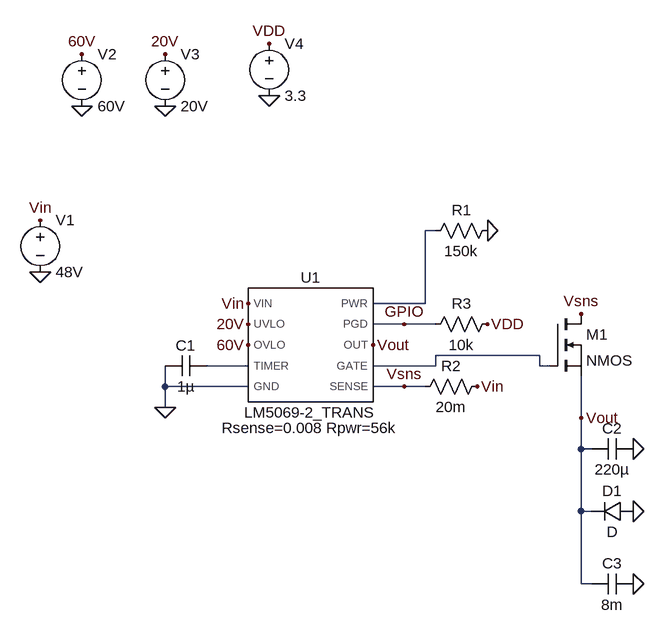
[diagram p0: schematic LM5069_SPICE.asc]
LM5069_SPICE.asc, the LTspice schematic file:
Version 4
SHEET 1 880 680
WIRE 432 -48 416 -48
WIRE 416 64 416 -48
WIRE 416 64 336 64
WIRE 384 96 336 96
WIRE 432 96 384 96
WIRE 592 144 432 144
WIRE 144 160 80 160
WIRE 432 160 432 144
WIRE 432 160 336 160
WIRE 592 160 592 144
WIRE 608 160 592 160
WIRE 16 192 16 160
WIRE 144 192 16 192
WIRE 384 192 336 192
WIRE 416 192 384 192
WIRE 16 224 16 192
WIRE 656 240 656 176
WIRE 656 288 656 240
WIRE 672 288 656 288
WIRE 656 384 656 288
WIRE 672 384 656 384
WIRE 656 496 656 384
WIRE 672 496 656 496
FLAG -176 16 0
FLAG 16 224 0
FLAG -176 -64 Vin
FLAG 144 64 Vin
FLAG 512 -48 0
FLAG 336 128 Vout
FLAG -112 -240 0
FLAG 16 -240 0
FLAG -112 -320 60V
FLAG 144 128 60V
FLAG 16 -320 20V
FLAG 144 96 20V
FLAG 176 -336 VDD
FLAG 176 -256 0
FLAG 512 96 VDD
FLAG 384 96 GPIO
FLAG 656 240 Vout
FLAG 656 80 Vsns
FLAG 736 288 0
FLAG 736 384 0
FLAG 736 496 0
FLAG 384 192 Vsns
FLAG 496 192 Vin
SYMBOL LM5069-2_TRANS 240 128 R0
SYMATTR InstName U1
SYMBOL voltage -176 -80 R0
WINDOW 123 0 0 Left 0
WINDOW 39 0 0 Left 0
SYMATTR InstName V1
SYMATTR Value 48V
SYMBOL res 528 -64 R90
WINDOW 0 0 56 VBottom 2
WINDOW 3 32 56 VTop 2
SYMATTR InstName R1
SYMATTR Value 150k
SYMBOL res 512 176 R90
WINDOW 0 0 56 VBottom 2
WINDOW 3 32 56 VTop 2
SYMATTR InstName R2
SYMATTR Value 20m
SYMBOL cap 80 144 R90
WINDOW 0 0 32 VBottom 2
WINDOW 3 32 32 VTop 2
SYMATTR InstName C1
SYMATTR Value 1µ
SYMBOL nmos 608 80 R0
SYMATTR InstName M1
SYMBOL voltage -112 -336 R0
WINDOW 123 0 0 Left 0
WINDOW 39 0 0 Left 0
SYMATTR InstName V2
SYMATTR Value 60V
SYMBOL voltage 16 -336 R0
WINDOW 123 0 0 Left 0
WINDOW 39 0 0 Left 0
SYMATTR InstName V3
SYMATTR Value 20V
SYMBOL voltage 176 -352 R0
WINDOW 123 0 0 Left 0
WINDOW 39 0 0 Left 0
SYMATTR InstName V4
SYMATTR Value 3.3
SYMBOL res 528 80 R90
WINDOW 0 0 56 VBottom 2
WINDOW 3 32 56 VTop 2
SYMATTR InstName R3
SYMATTR Value 10k
SYMBOL diode 736 368 R90
WINDOW 0 0 32 VBottom 2
WINDOW 3 32 32 VTop 2
SYMATTR InstName D1
SYMBOL cap 736 272 R90
WINDOW 0 0 32 VBottom 2
WINDOW 3 32 32 VTop 2
SYMATTR InstName C2
SYMATTR Value 220µ
SYMBOL cap 736 480 R90
WINDOW 0 0 32 VBottom 2
WINDOW 3 32 32 VTop 2
SYMATTR InstName C3
SYMATTR Value 8m

The netlist it stands for:
* LM5069_SPICE.asc
XU1 Vin 20V 60V N003 0 N001 GPIO Vout N002 Vsns LM5069-2_TRANS Rsense=0.008 Rpwr=56k  ; pins VIN UVLO OVLO TIMER GND PWR PGD OUT GATE SENSE
V1 Vin 0 48V
R1 0 N001 150k
R2 Vin Vsns 20m
C1 N003 0 1µ
M1 Vsns N002 Vout Vout NMOS
V2 60V 0 60V
V3 20V 0 20V
V4 VDD 0 3.3
R3 VDD GPIO 10k
D1 0 Vout D
C2 0 Vout 220µ
C3 0 Vout 8m
.model D D
.lib standard.dio
.model NMOS NMOS
.model PMOS PMOS
.lib standard.mos
.lib C:\Users\johna\Documents\BYTE_Electronics\Good_Boy_Limiter\SPICE\lm5069-2_trans.lib
.backanno
.end